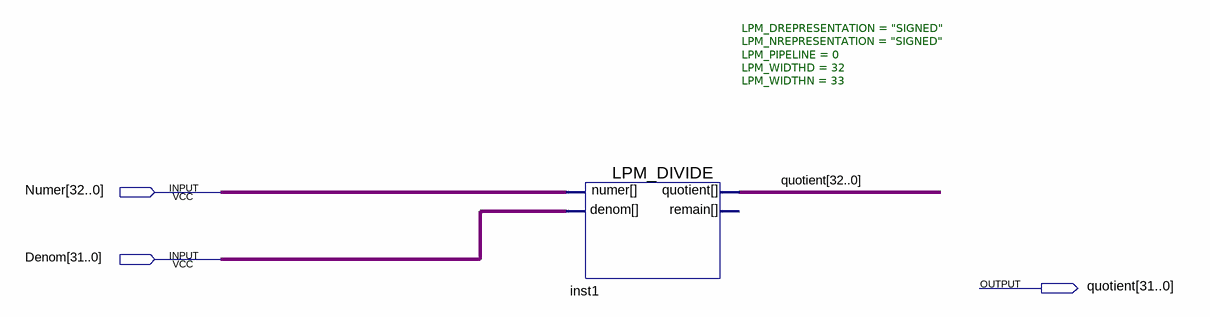
[diagram p0: schematic sheet]
// Quartus schematic TwoInputSigned33_Divide.bdf as structural Verilog: 1 symbols, 3 pins
module TwoInputSigned33_Divide (
  input  [32:0] Numer,
  input  [31:0] Denom,
  output [32:0] quotient
);

  LPM_DIVIDE #(.LPM_DREPRESENTATION("SIGNED"), .LPM_NREPRESENTATION("SIGNED"), .LPM_PIPELINE(0), .LPM_WIDTHD(32), .LPM_WIDTHN(33)) inst1 (
    .denom(Denom), .numer(Numer), .quotient(quotient));  // open: remain
endmodule
